# Altium schematic sheet Laadstation.SchDoc
size A4; SheetNumber: 1; SheetTotal: 2
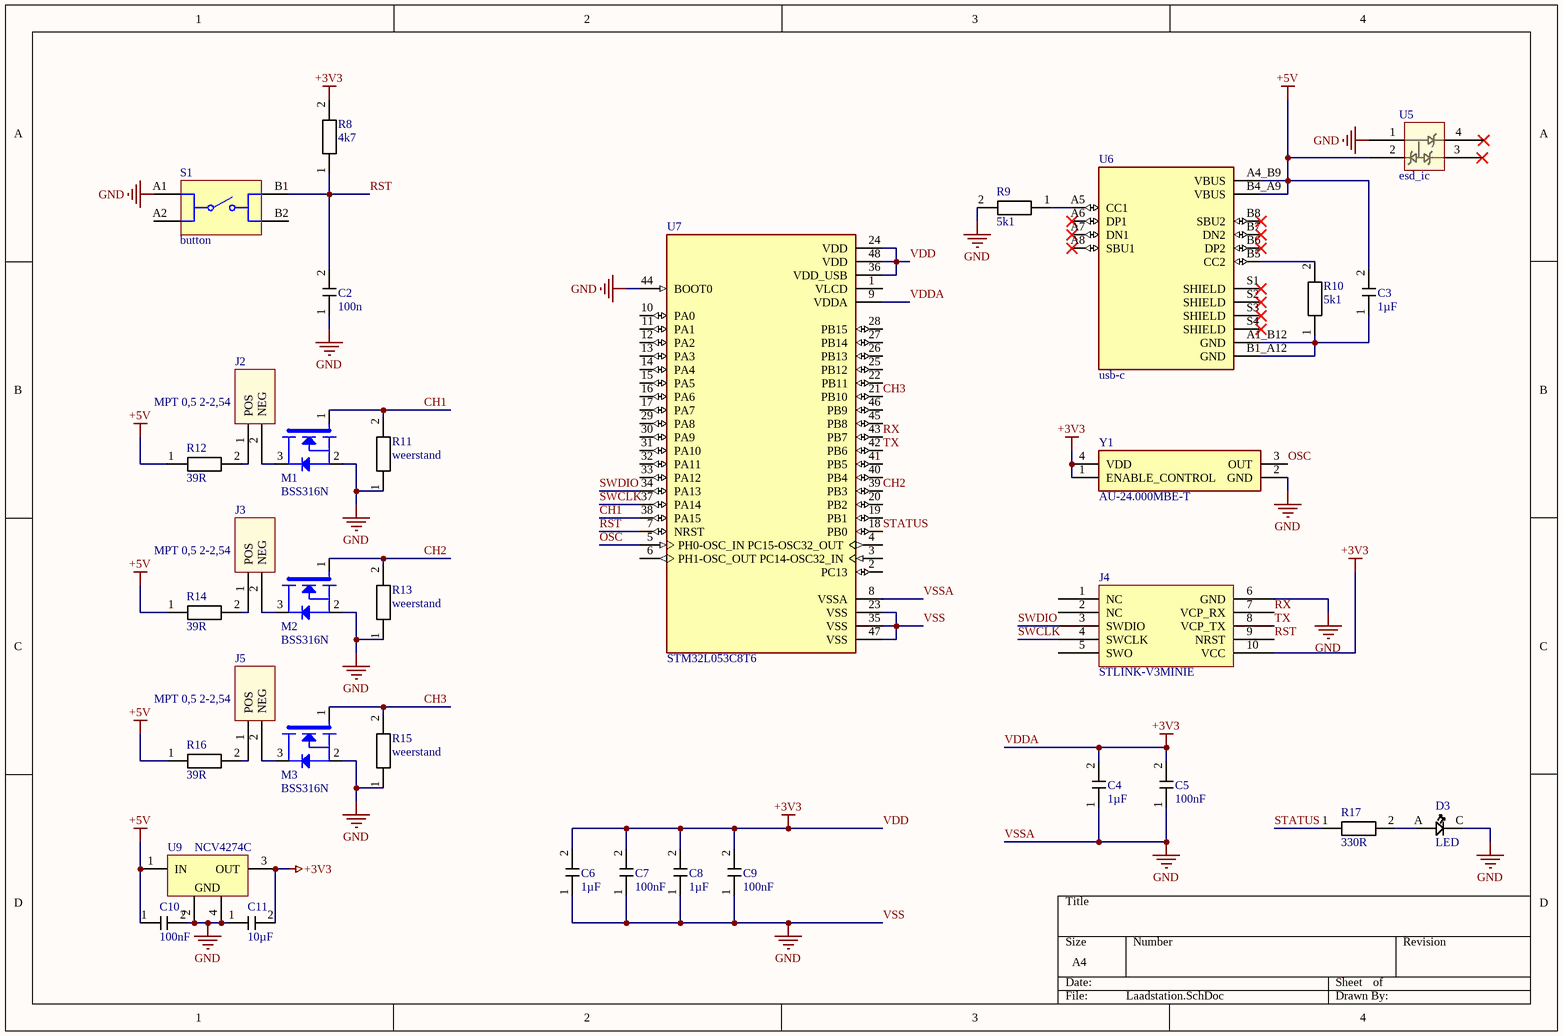
[diagram p0: Laadstation.SchDoc]

## Parts
C2  100n  [0603]
C3  1µF  [0603]
C4  1µF  [0603]
C5  100nF  [0603]
C6  1µF  [0603]
C7  100nF  [0603]
C8  1µF  [0603]
C9  100nF  [0603]
C10  100nF  [0603]
C11  10µF  [0603]
D3  LED  [LED]
J2  MPT 0,5 2-2,54  [MPT 0,5 2-2,54]
J3  MPT 0,5 2-2,54  [MPT 0,5 2-2,54]
J4  STLINK-V3MINIE  [STLINK-V3MINIE]
J5  MPT 0,5 2-2,54  [MPT 0,5 2-2,54]
M1  BSS316N  [BSS316N]
M2  BSS316N  [BSS316N]
M3  BSS316N  [BSS316N]
R8  4k7  [0603]
R9  5k1  [0603]
R10  5k1  [0603]
R11  weerstand  [0603]
R12  39R  [0603]
R13  weerstand  [0603]
R14  39R  [0603]
R15  weerstand  [0603]
R16  39R  [0603]
R17  330R  [0603]
S1  button  [BUTTON]
U5  esd_ic  [esd_ic]
U6  usb-c  [usb-c]
U7  STM32L053C8T6  [stm32l053c8t6]
U9  NCV4274C  [NCV4274C]
Y1  AU-24.000MBE-T  [AU-24.000MBE-T]

## Nets
+5V: C3.2(G) C10.1(G) R12.1 R14.1 R16.1 U5.2 U6.A4_B9(VBUS) U6.B4_A9(VBUS) U9.1(IN)
VDD: C4.2(G) C5.2(G) C6.2(G) C7.2(G) C8.2(G) C9.2(G) C11.2(G) J4.10(VCC) R8.2(G) U7.9(VDDA) U7.24(VDD) U7.36(VDD_USB) U7.48(VDD) U9.3(OUT) Y1.1(ENABLE_CONTROL) Y1.4(VDD)  [also labelled +3V3, VDDA]
VSS: C2.1(G) C4.1(G) C5.1(G) C6.1(G) C7.1(G) C8.1(G) C9.1(G) C10.2(G) C11.1(G) D3.C J4.6(GND) M1.2(S) M2.2(S) M3.2(S) R9.2(G) R11.1 R13.1 R15.1 S1.A1 U5.1 U7.8(VSSA) U7.23(VSS) U7.35(VSS) U7.44(BOOT0) U7.47(VSS) U9.2(GND) U9.4(GND) Y1.2(GND)  [also labelled GND, VSSA]
CH1: M1.1(G) R11.2(G) U7.38(PA15)
CH2: M2.1(G) R13.2(G) U7.39(PB3)
CH3: M3.1(G) R15.2(G) U7.21(PB10)
OSC: U7.5(PH0-OSC_IN) Y1.3(OUT)
RST: C2.2(G) J4.9(NRST) R8.1 S1.B1 U7.7(NRST)
RX: J4.7(VCP_RX) U7.43(PB7)
STATUS: R17.1 U7.18(PB0)
SWCLK: J4.4(SWCLK) U7.37(PA14)
SWDIO: J4.3(SWDIO) U7.34(PA13)
TX: J4.8(VCP_TX) U7.42(PB6)
NetC3_1: C3.1(G) R10.1 U6.A1_B12(GND) U6.B1_A12(GND)
NetD3_A: D3.A R17.2(G)
NetJ2_1: J2.1(POS) R12.2(G)
NetJ2_2: J2.2(NEG) M1.3(D)
NetJ3_1: J3.1(POS) R14.2(G)
NetJ3_2: J3.2(NEG) M2.3(D)
NetJ5_1: J5.1(POS) R16.2(G)
NetJ5_2: J5.2(NEG) M3.3(D)
NetR9_1: R9.1 U6.A5(CC1)
NetR10_2: R10.2(G) U6.B5(CC2)

Not connected (* = marked no-connect by the designer): J4 1(NC) 2(NC) 5(SWO); S1 A2 B2; U5 3* 4*; U6 A6(DP1)* A7(DN1)* A8(SBU1)* B6(DP2)* B7(DN2)* B8(SBU2)* S1(SHIELD)* S2(SHIELD)* S3(SHIELD)* S4(SHIELD)*; U7 1(VLCD) 2(PC13) 3(PC14-OSC32_IN) 4(PC15-OSC32_OUT) 6(PH1-OSC_OUT) 10(PA0) 11(PA1) 12(PA2) 13(PA3) 14(PA4) 15(PA5) 16(PA6) 17(PA7) 19(PB1) 20(PB2) 22(PB11) 25(PB12) 26(PB13) 27(PB14) 28(PB15) 29(PA8) 30(PA9) 31(PA10) 32(PA11) 33(PA12) 40(PB4) 41(PB5) 45(PB8) 46(PB9)

## Library data of the parts
C2 C3 C6-C9 = Condensator
C4 C5 C10 C11 = cap
R8-R10 R12 R14 R16 R17 = weerstand